# EAGLE design Featherwing Version (EAGLE 9.3.0)
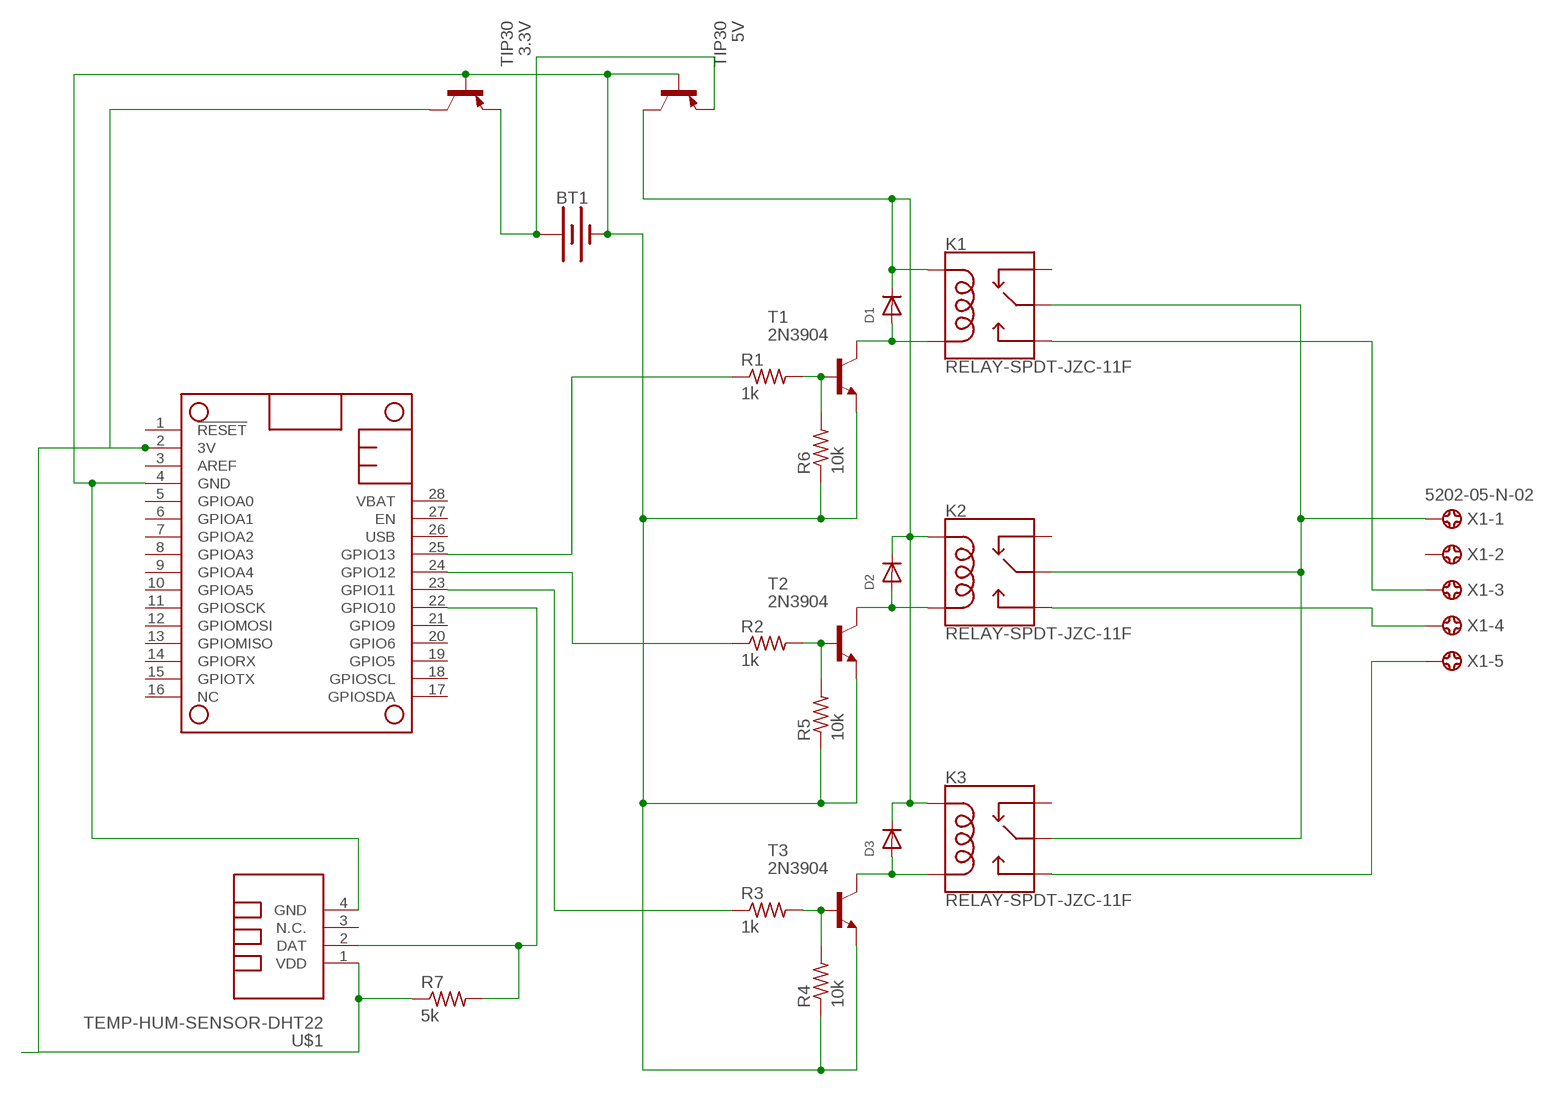
[diagram p0: schematic, sheet 1]

## Parts
3.3V  TIP30  [TO220]
5V  TIP30  [TO220]
BT1  BATTERY-9V  [BATTCON_9V]
D1  DIODEDO-1N4148  [DO-1N4148]
D2  DIODEDO-1N4148  [DO-1N4148]
D3  DIODEDO-1N4148  [DO-1N4148]
K1  RELAY-SPDT-JZC-11F  [RELAY-JZC]
K2  RELAY-SPDT-JZC-11F  [RELAY-JZC]
K3  RELAY-SPDT-JZC-11F  [RELAY-JZC]
MS2  FEATHERWING  [FEATHERWING]
R1  1k  R-US_0309/10  [0309/10]
R2  1k  R-US_0309/10  [0309/10]
R3  1k  R-US_0309/10  [0309/10]
R4  10k  R-US_0309/10  [0309/10]
R5  10k  R-US_0309/10  [0309/10]
R6  10k  R-US_0309/10  [0309/10]
R7  5k  R-US_0309/10  [0309/10]
T1  2N3904  [TO92]
T2  2N3904  [TO92]
T3  2N3904  [TO92]
U$1  TEMP-HUM-SENSOR-DHT22  [TEMP-HUM-SENSOR-DHT22]
X1  5202-05-N-02  [5202-05-N-02]

## Nets
3V: 3.3V.2(C) MS2.2(3V) R7.1 U$1.1(VDD)
N$1: MS2.22(GPIO10) R7.2 U$1.2(DAT)
N$2: D2.A K2.1(COIL2) T2.1(C)
N$4: D3.A K3.1(COIL2) T3.1(C)
N$5: 5V.2(C) D1.C D2.C D3.C K1.5(COIL1) K2.5(COIL1) K3.5(COIL1)
N$6: D1.A K1.1(COIL2) T1.1(C)
N$7: K1.4(MAIN) K2.4(MAIN) K3.4(MAIN) X1.1
N$8: K1.3(NO) X1.3
N$9: K2.3(NO) X1.4
N$10: K3.3(NO) X1.5
N$11: R3.2 R4.2 T3.2(B)
N$12: R2.2 R5.2 T2.2(B)
N$13: R1.2 R6.2 T1.2(B)
N$14: 3.3V.1(B) 5V.1(B) BT1.- MS2.4(GND) R4.1 R5.1 R6.1 T1.3(E) T2.3(E) T3.3(E) U$1.4(GND)
N$15: 3.3V.3(E) 5V.3(E) BT1.+
N$19: MS2.25(GPIO13) R1.1
N$20: MS2.24(GPIO12) R2.1
N$21: MS2.23(GPIO11) R3.1
Unconnected: K1.2(NC) K2.2(NC) K3.2(NC) MS2.1(!RESET) MS2.3(AREF) MS2.5(GPIOA0) MS2.6(GPIOA1) MS2.7(GPIOA2) MS2.8(GPIOA3) MS2.9(GPIOA4) MS2.10(GPIOA5) MS2.11(GPIOSCK) MS2.12(GPIOMOSI) MS2.13(GPIOMISO) MS2.14(GPIORX) MS2.15(GPIOTX) MS2.16(NC) MS2.17(GPIOSDA) MS2.18(GPIOSCL) MS2.19(GPIO5) MS2.20(GPIO6) MS2.21(GPIO9) MS2.26(USB) MS2.27(EN) MS2.28(VBAT) U$1.3(N.C.) X1.2

## Library data of the parts
3.3V 5V = adafruit:TIP30: PNP Transistor
BT1 = SparkFun-Batteries:BATTERY: Battery - Single Cell A variety of battery chemistries, sizes, and footprints. Device List: 20MM_PTH - Coin Cell Battery Holder - 20mm (PTH) <https://www.sparkfun.com/products/783> 6.8MM_PTH - Coin Cell Battery Holder - 6.8MM(SMD) <https://www.digikey.com/product-detail/en/seiko-instruments/MS621FE-FL11E/728-1057-ND/1889208?WT.srch=1&gclid=CNOQ5a6LzdQCFZS2wAodXCkE0g> 12MM_SMD - Coin Cell Battery Holder - 12mm (SMD) <https://www.sparkfun.com/products/10592> 12MM_PTH - Coin Cell Battery Holder - 12mm (PTH) <https://www.sparkfun.com/products/7948> 20MM_SMD - 20mm Coin Cell Battery Holder (SMD) (2 legs) Used on the Big Time Watch Kit <https://www.sparkfun.com/products/11734> 20MM_SMD_4LEGS - Coin Cell Battery Holder - 20mm (SMD) <https://www.sparkfun.com/products/11892> 20MM_SMD_4LEGS_OVERPASTE - Coin Cell Battery Holder - 20mm (SMD) <https://www.sparkfun.com/products/11892> (Over-paste on the legs) 24.5MM_PTH - Coin Cell Battery Holder - 24.5mm (PTH) <https://www.sparkfun.com/products/8863> 9V - 9V Battery Holder - PC Mount Used on the SparkFun SparkPunk Sound Kit <https://www.sparkfun.com/products/11177> and SparkFun SparkPunk Sequencer Kit <https://www.sparkfun.com/products/12707> 18650 - Battery Holder - 18650 (PTH) <https://www.sparkfun.com/products/13113> AA - Battery Holder - 1xAA (PTH) <https://www.sparkfun.com/products/7949> AAA - Battery Holder - 1xAAA (PTH) <https://www.sparkfun.com/products/12718> AA_KIT - Battery Holder - 1xAA (PTH) <https://www.sparkfun.com/products/7949> Special kit package - pads only have exposed copper on one side of the board. AAA_KIT - Battery Holder - 1xAAA (PTH) <https://www.sparkfun.com/products/12718> Special kit package - pads only have exposed copper on one side of the board.; PROD_ID: BATT-10855
D1-D3 = adafruit:DIODE: Diode SMADIODE - SMA Surface Mount Package 20V 1A Schottky Diode Digikey: 641-1014-6-ND DO-1N4148 - Through Hole Small Current Diode SOD-123 20V 1 A (.5mV Vf) Schottky Diode - Digikey: MBRX120TPMSCT-ND SOD-323 10V 570mA (.38mV Vf, 3ns) Schottky Diode - Digikey: ZLLS410CT-ND SOD-523 30V 30mA Schottky Diode (RB751S-40TE61) - Digikey: RB751S-40TE61CT-ND SOT23-R/W - SOT23 Package (R = Solder Paste/Reflow Ovens, W = Hand-Soldering) BAT54Film 40V 300mA - Digikey: 497-7162-1-ND
K1-K3 = SparkFun-Electromechanical:RELAY-SPDT: SPDT Electromechanical Relay Single-pole, double-throw sealed relays. When current is applied to the coil, it throws a simple changeover switch, terminating the connection from the NC contact to ground and closing the NO contact. Use them to switch high voltage/high current devices. SparkFun Products JQX-15F: Relay SPDT Sealed - 20A <https://www.sparkfun.com/products/10924> (COM-10924) JZC-11F: Relay SPDT Sealed <https://www.sparkfun.com/products/100> (COM-00100); PROD_ID: COMP-09533; SF_SKU: COM-00100
MS2 = adafruit:FEATHERWING
R1-R7 = adafruit:R-US_: RESISTOR, American symbol
T1-T3 = transistor:2N3904: NPN TRANSISTOR
U$1 = diy-modules:TEMP-HUM-SENSOR-DHT22: DHT22 - digital humidity & temperature sensor Also known as: AM2302 AM2302 datasheet available here: http://akizukidenshi.com/download/ds/aosong/AM2302.pdf Click here to find device on ebay.com <http://www.ebay.com/sch/dht22+digital+sensor>
X1 = con-ebyelectro:5202-05-N-02: Barrier Blocks Sreies 5202 Source: http://www.ebyelectro.com/PDF/5202-XX-N-02.pdf; OC_FARNELL: unknown; OC_NEWARK: unknown

## Board
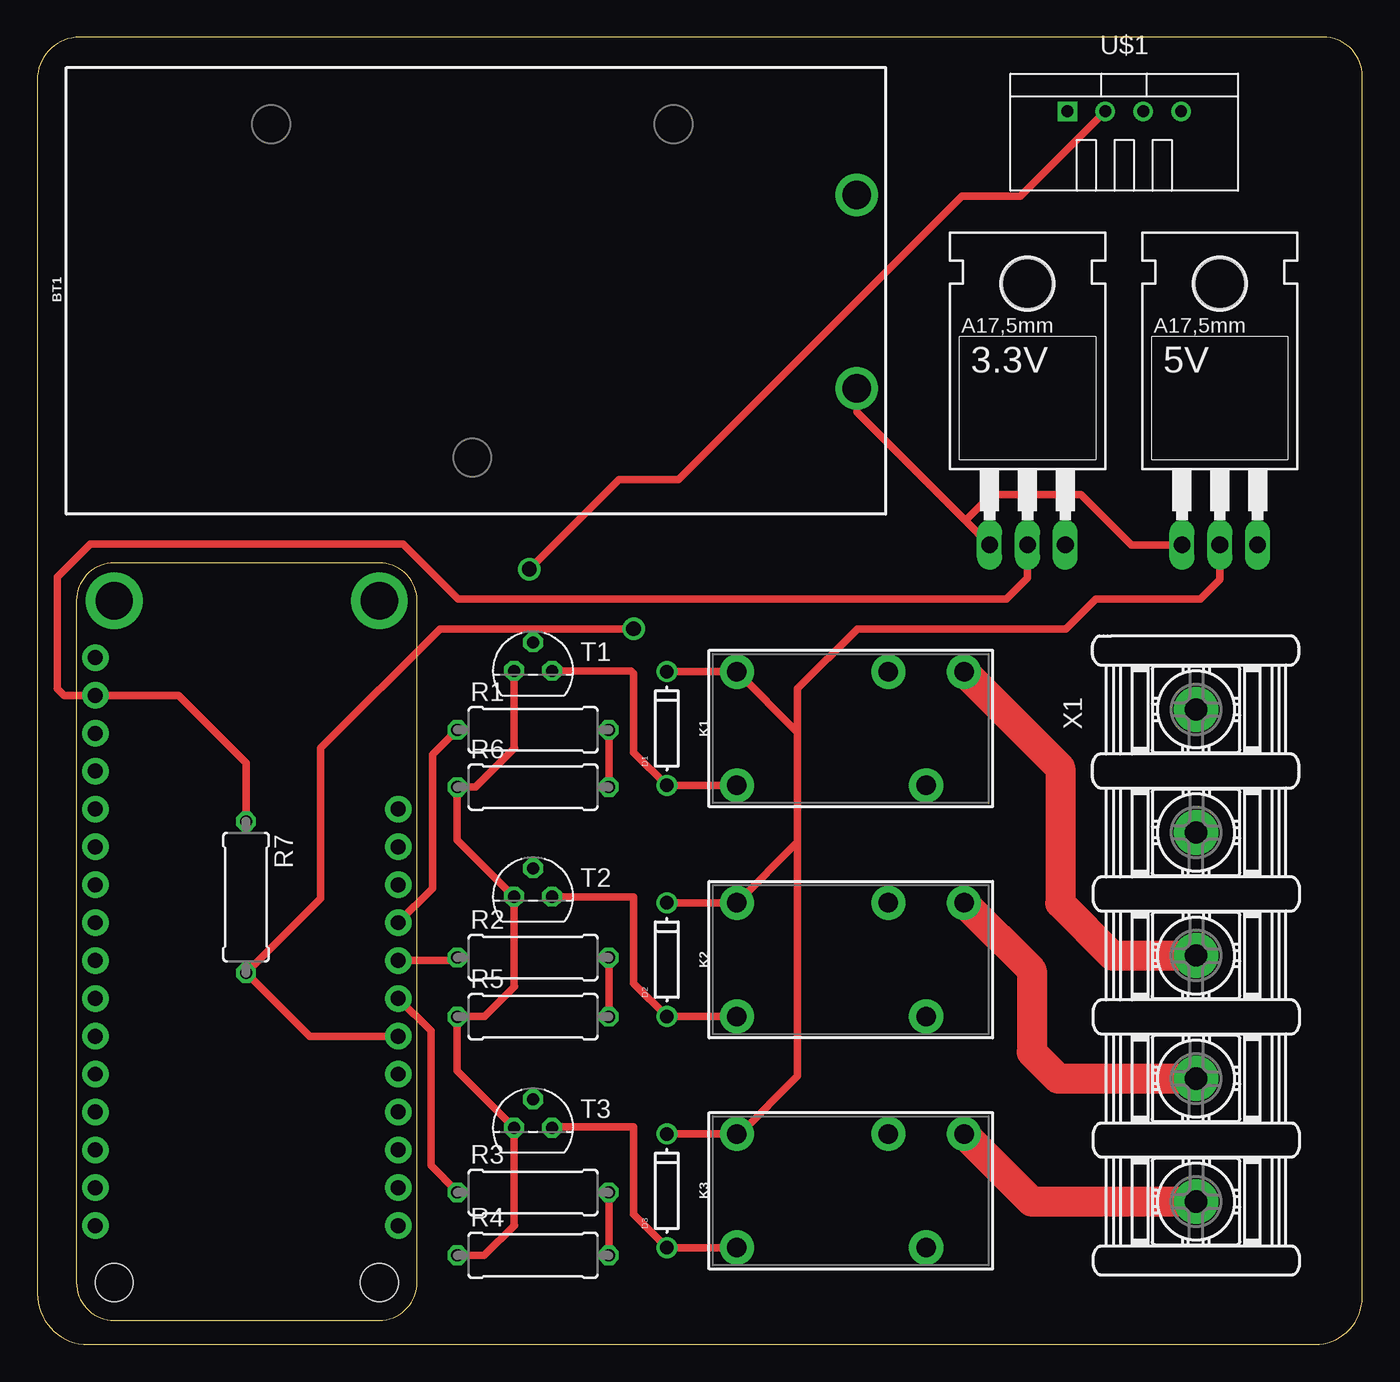
[diagram p1: board, top side]
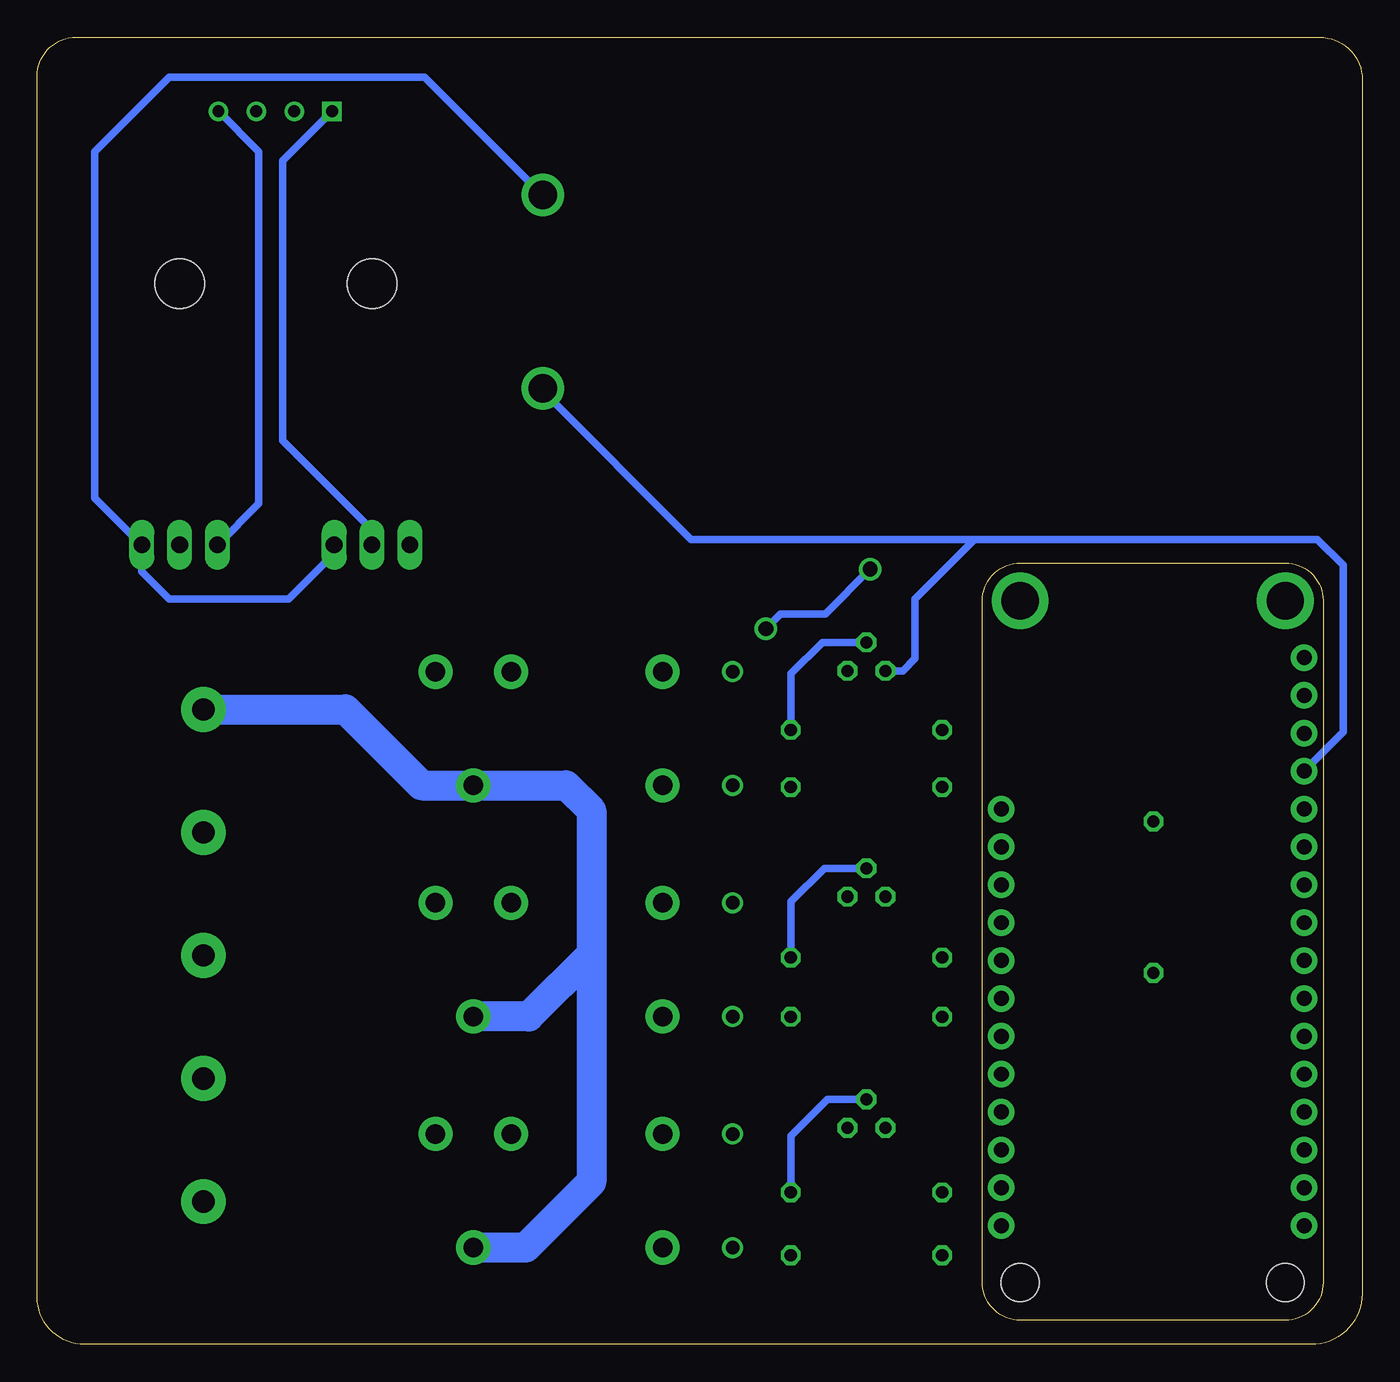
[diagram p2: board, bottom side, seen from below]

Size 88.86 x 87.67 mm. Coordinates in mm from the lower left corner, seen from the top.
Outline: 0,84.84 0,3.41 arc90 3.41,0 85.69,0 arc90 88.86,3.17 88.86,85.07 arc90 86.26,87.67 2.83,87.67 arc90 0,84.84
Copper layers (1*16): Top 0.035mm / dielectric 1.5mm / Bottom 0.035mm
Design rules "default *": minimum track width 20mil, minimum drill 1mm, track to track 6mil, track to pad 6mil, pad to pad 6mil, via to via 6mil, smd to smd 6mil, copper to edge 40mil, drill to drill 6mil, minimum pad ring 10mil, minimum via ring 8mil, stop-mask expansion 4mil, vias tented up to drill 0mil, thermal gap 10mil

### Footprints (pad centres in the part's own frame; a part is rotated, then mirrored left to right if it is on the bottom)
TO220 = drill 1.118 long: 1 -2.54,-6.35; 2 0,-6.35; 3 2.54,-6.35 | hole 3.302: 0,11.176
BATTCON_9V = drill 1.905: + 0,0; - 0,-12.954
DO-1N4148 = drill 0.9: A -3.81,0; C 3.81,0
RELAY-JZC = drill 1.3 pad 2.286: 1 3.81,-8.89; 2 -3.81,1.27; 3 -3.81,6.35; 4 3.81,3.81; 5 -3.81,-8.89
FEATHERWING = drill 1 pad 1.778: 1 6.35,1.27; 2 8.89,1.27; 3 11.43,1.27; 4 13.97,1.27; 5 16.51,1.27; 6 19.05,1.27; 7 21.59,1.27; 8 24.13,1.27; 9 26.67,1.27; 10 29.21,1.27; 11 31.75,1.27; 12 34.29,1.27; 13 36.83,1.27; 14 39.37,1.27; 15 41.91,1.27; 16 44.45,1.27; 17 44.45,21.59; 18 41.91,21.59; 19 39.37,21.59; 20 36.83,21.59; 21 34.29,21.59; 22 31.75,21.59; 23 29.21,21.59; 24 26.67,21.59; 25 24.13,21.59; 26 21.59,21.59; 27 19.05,21.59; 28 16.51,21.59 | drill 2.5 pad 3.81: P$1 2.54,20.32; P$2 2.54,2.54 | hole 2.54: 48.26,20.32; 48.26,2.54
0309/10 = drill 0.813 octagon: 1 -5.08,0; 2 5.08,0
TO92 = drill 0.813 octagon: 1 1.27,0; 2 0,1.905; 3 -1.27,0
TEMP-HUM-SENSOR-DHT22 = drill 0.8 square: 1 -3.81,0 | drill 0.8: 2 -1.27,0; 3 1.27,0; 4 3.81,0
5202-05-N-02 = drill 1.5 pad 3: 1 -16.5,0; 2 -8.25,0; 3 0,0; 4 8.25,0; 5 16.5,0

### Placement (x,y rotation side)
3.3V  66.41,59.98 0 top
5V  79.31,59.98 0 top
BT1  54.96,77.09 0 top
D1  42.22,41.31 90 top
D2  42.22,25.81 90 top
D3  42.22,10.31 90 top
K1  55.8,41.31 270 top
K2  55.8,25.81 270 top
K3  55.8,10.31 270 top
MS2  2.62,52.42 270 top
R1  33.25,41.22 0 top
R2  33.25,25.95 0 top
R3  33.25,10.2 0 top
R4  33.25,5.98 0 top
R5  33.25,21.98 0 top
R6  33.25,37.38 0 top
R7  14,30 270 top
T1  33.25,45.18 0 top
T2  33.25,30.03 0 top
T3  33.25,14.53 0 top
U$1  72.9,82.7 0 top
X1  77.71,26.09 270 top

### Tracks (layer width: path | path; a pad name or v marks a point on that pad's centre or on a via)
3V
  Top 0.508: R7.1 14,39 9.47,43.53 MS2.2 1.82,43.53 1.35,44 1.35,51.48 3.56,53.69 24.54,53.69 28.23,50 65,50 66.41,51.41 3.3V.2
  Bottom 0.508: 3.3V.2 66.41,54.62 72.41,60.62 72.41,79.38 U$1.1
N$1  (via drill 1)
  Top 0.508: MS2.22 18.25,20.67 R7.2 19,29.92 19,40 27,48 v40,48 | U$1.2 65.93,77 62,77 43,58 39,58 v33,52
  Bottom 0.508: v33,52 36,49 39,49 v40,48
N$2
  Top 0.508: K2.1 D2.A 40,24.22 40,30 39.97,30.03 T2.1
N$4
  Top 0.508: K3.1 D3.A 40,8.72 40,14.6 34.59,14.6 T3.1
N$5
  Top 0.508: 51,41.03 K1.5 D1.C | 51,41.03 51,33.7 | 51,33.7 51,18 47.12,14.12 K3.5 D3.C | 51,33.7 K2.5 D2.C | 5V.2 79.31,51.31 78,50 71,50 69,48 55,48 51,44 51,41.03
N$6
  Top 0.508: K1.1 D1.A 40,39.72 40,45 39.82,45.18 T1.1
N$7
  Bottom 2: X1.1 68.19,42.59 63.1,37.5 K1.4 53.4,37.5 51.7,35.8 51.7,26.2 | 51.7,26.2 55.9,22 K2.4 | 51.7,26.2 51.7,10.9 56.1,6.5 K3.4
N$8
  Top 2: K1.3 68.6,38.67 68.6,29.6 72.11,26.09 X1.3
N$9
  Top 2: K2.3 66.7,25.07 66.7,19.6 68.46,17.84 X1.4
N$10
  Top 2: K3.3 66.69,9.59 X1.5
N$11
  Top 0.508: R3.2 R4.2
  Bottom 0.508: T3.2 35.87,16.43 38.3,14 38.3,10.23 R3.2
N$12
  Top 0.508: R5.2 R2.2
  Bottom 0.508: T2.2 36.06,31.93 38.3,29.7 38.3,25.98 R2.2
N$13
  Top 0.508: R6.2 R1.2
  Bottom 0.508: T1.2 36.22,47.09 38.3,45 38.3,41.25 R1.2
N$14
  Top 0.508: R4.1 29.98,5.98 32,8 31.98,8.02 T3.3 28.17,18.34 R5.1 28.19,22 30,22 32,24 31.98,24.02 T2.3 28.17,33.84 R6.1 29.38,37.38 32,40 31.98,40.02 T1.3 | 3.3V.1 62.25,55.25 | 62.25,55.25 54.96,62.53 BT1.- | 5V.1 73.38,53.62 70,57 64,57 62.25,55.25
  Bottom 0.508: BT1.- 55.1,64 55,64 45,54 26,54 | MS2.4 1.27,41.07 1.27,52.27 3,54 26,54 | 26,54 30,50 30,46 30.82,45.18 T1.3 | 5V.1 74,56.4 74,79.99 U$1.4
N$15
  Top 0.508: BT1.+ 54.96,77.04
  Bottom 0.508: 3.3V.3 68.95,53.05 72,50 80,50 81.85,51.85 5V.3 85,56.77 85,80 80,85 62.87,85 BT1.+
N$19
  Top 0.508: MS2.25 26.5,30.58 26.5,39.55 R1.1
N$20
  Top 0.508: MS2.24 27.97,25.75 R2.1
N$21
  Top 0.508: MS2.23 26.4,21.02 26.4,12 28.17,10.23 R3.1